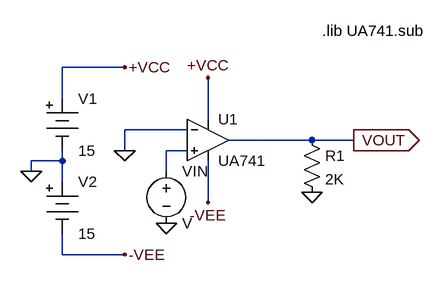
[diagram p0: schematic UA741_dcac.asc]
UA741_dcac.asc, the LTspice schematic file:
Version 4
SHEET 1 880 680
WIRE 48 32 -48 32
WIRE -48 80 -48 32
WIRE 176 112 176 48
WIRE 144 128 48 128
WIRE 336 144 208 144
WIRE 400 144 336 144
WIRE 48 160 48 128
WIRE 144 160 112 160
WIRE -48 176 -48 160
WIRE -48 176 -96 176
WIRE -96 192 -96 176
WIRE 112 192 112 160
WIRE -48 208 -48 176
WIRE 176 240 176 176
WIRE -48 320 -48 288
WIRE 48 320 -48 320
FLAG -96 192 0
FLAG 48 160 0
FLAG 336 224 0
FLAG 48 32 +VCC
FLAG 176 48 +VCC
FLAG 48 320 -VEE
FLAG 176 240 -VEE
FLAG 112 272 0
FLAG 400 144 VOUT
IOPIN 400 144 Out
SYMBOL Opamps\\opamp2 176 80 R0
SYMATTR InstName U1
SYMATTR Value UA741
SYMBOL res 320 128 R0
SYMATTR InstName R1
SYMATTR Value 2K
SYMBOL Misc\\battery -48 64 R0
WINDOW 123 0 0 Left 2
WINDOW 39 0 0 Left 2
SYMATTR InstName V1
SYMATTR Value 15
SYMBOL Misc\\battery -48 192 R0
WINDOW 123 0 0 Left 2
WINDOW 39 0 0 Left 2
SYMATTR InstName V2
SYMATTR Value 15
SYMBOL voltage 112 176 R0
SYMATTR InstName VIN
TEXT 352 -24 Left 2 !.lib UA741.sub

The netlist it stands for:
* UA741_dcac.asc
XU1 N001 0 +VCC -VEE VOUT UA741  ; pins In+ In- V+ V- OUT
R1 VOUT 0 2K
V1 +VCC 0 15
V2 0 -VEE 15
VIN N001 0 V
.lib UA741.sub
.backanno
.end